# Altium project hwcb.PrjPcb
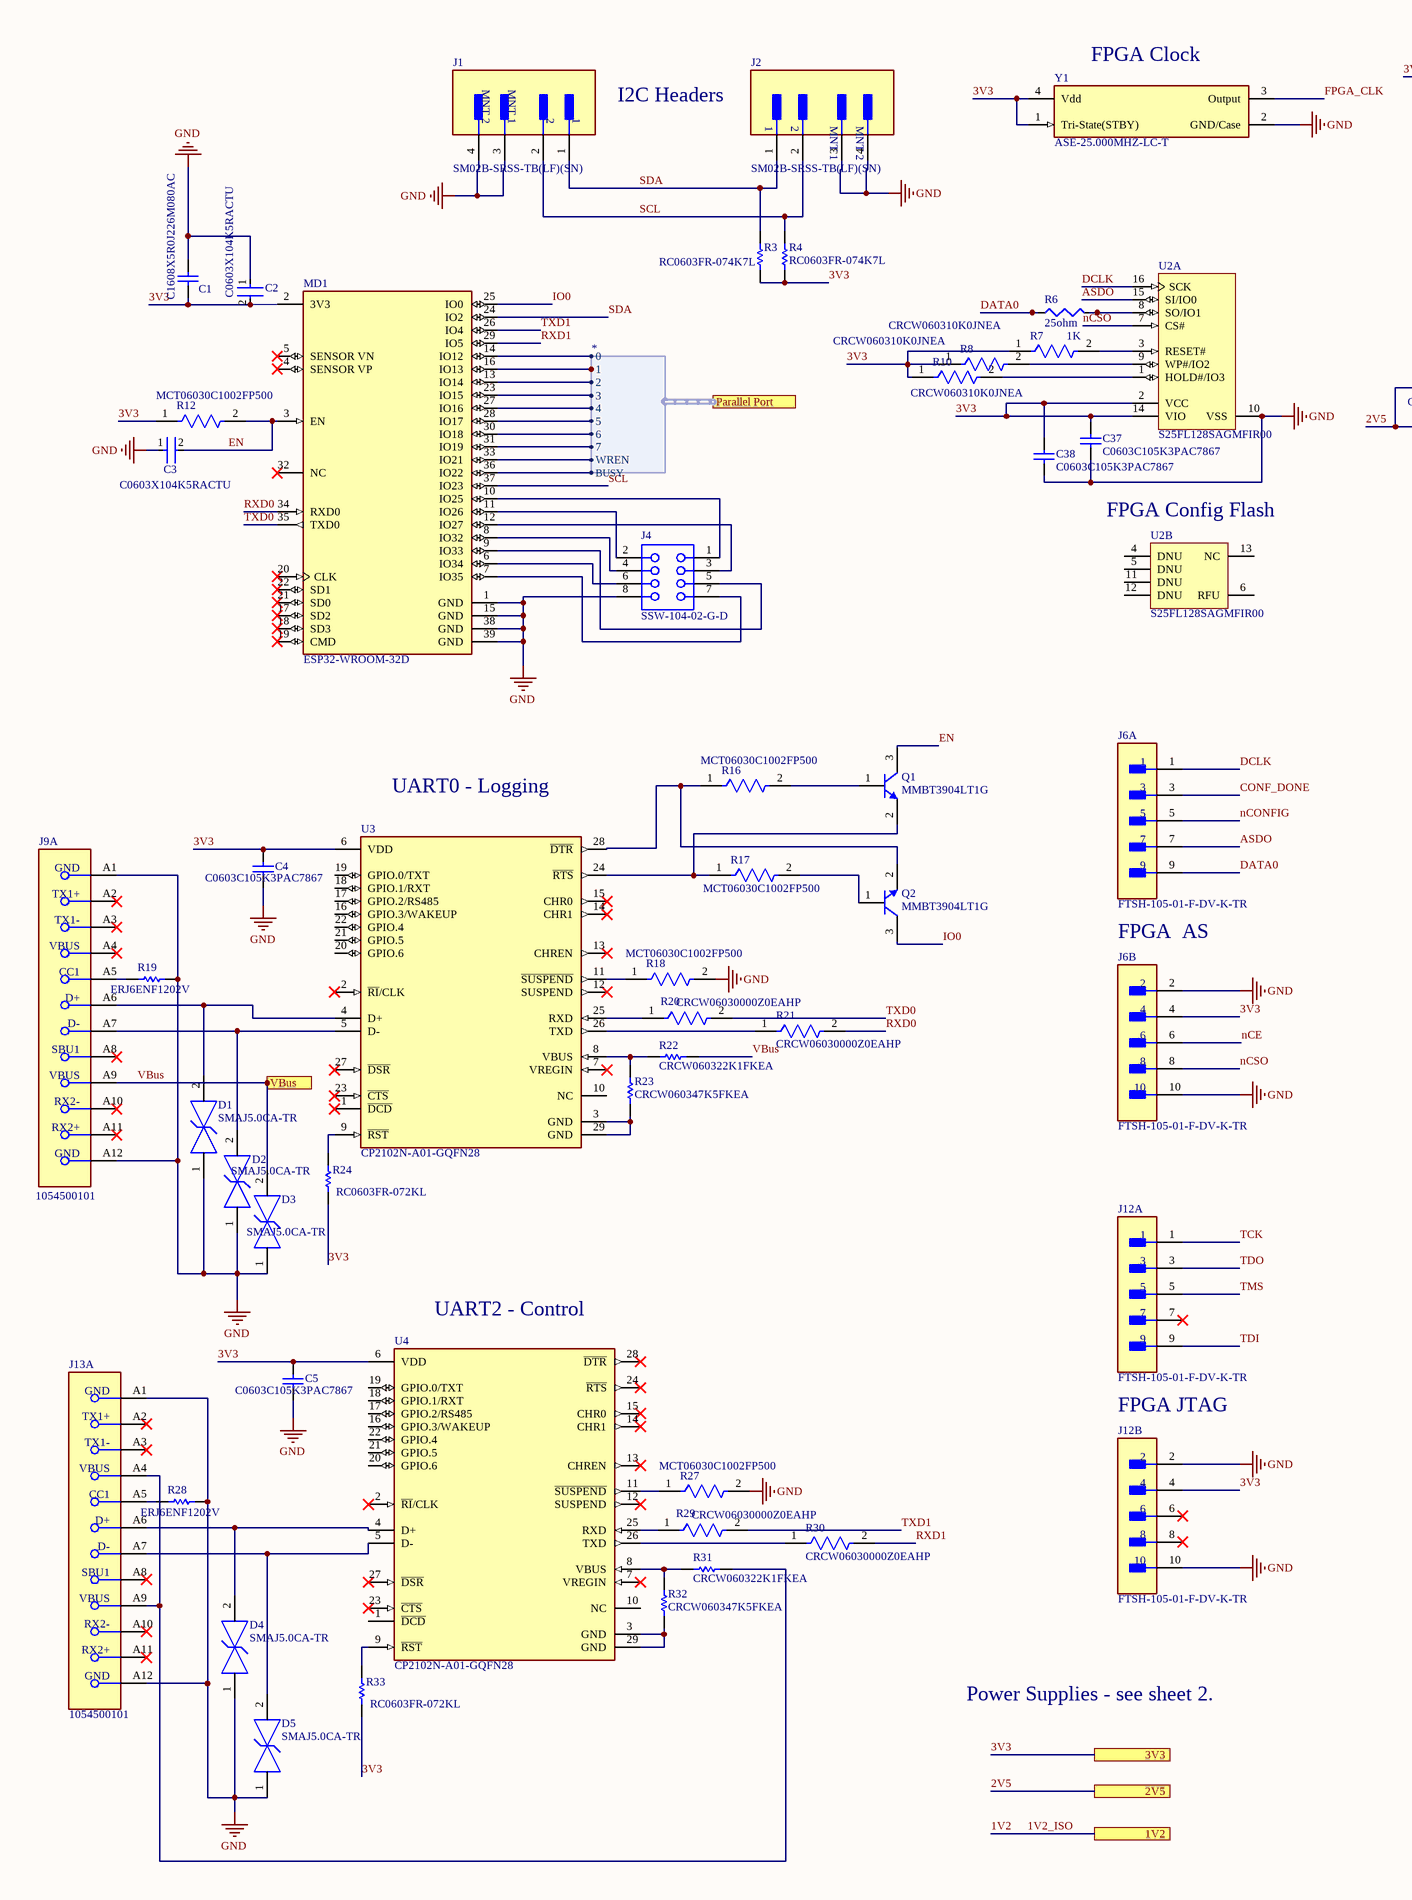
[diagram p0: hwcb.SchDoc, left]
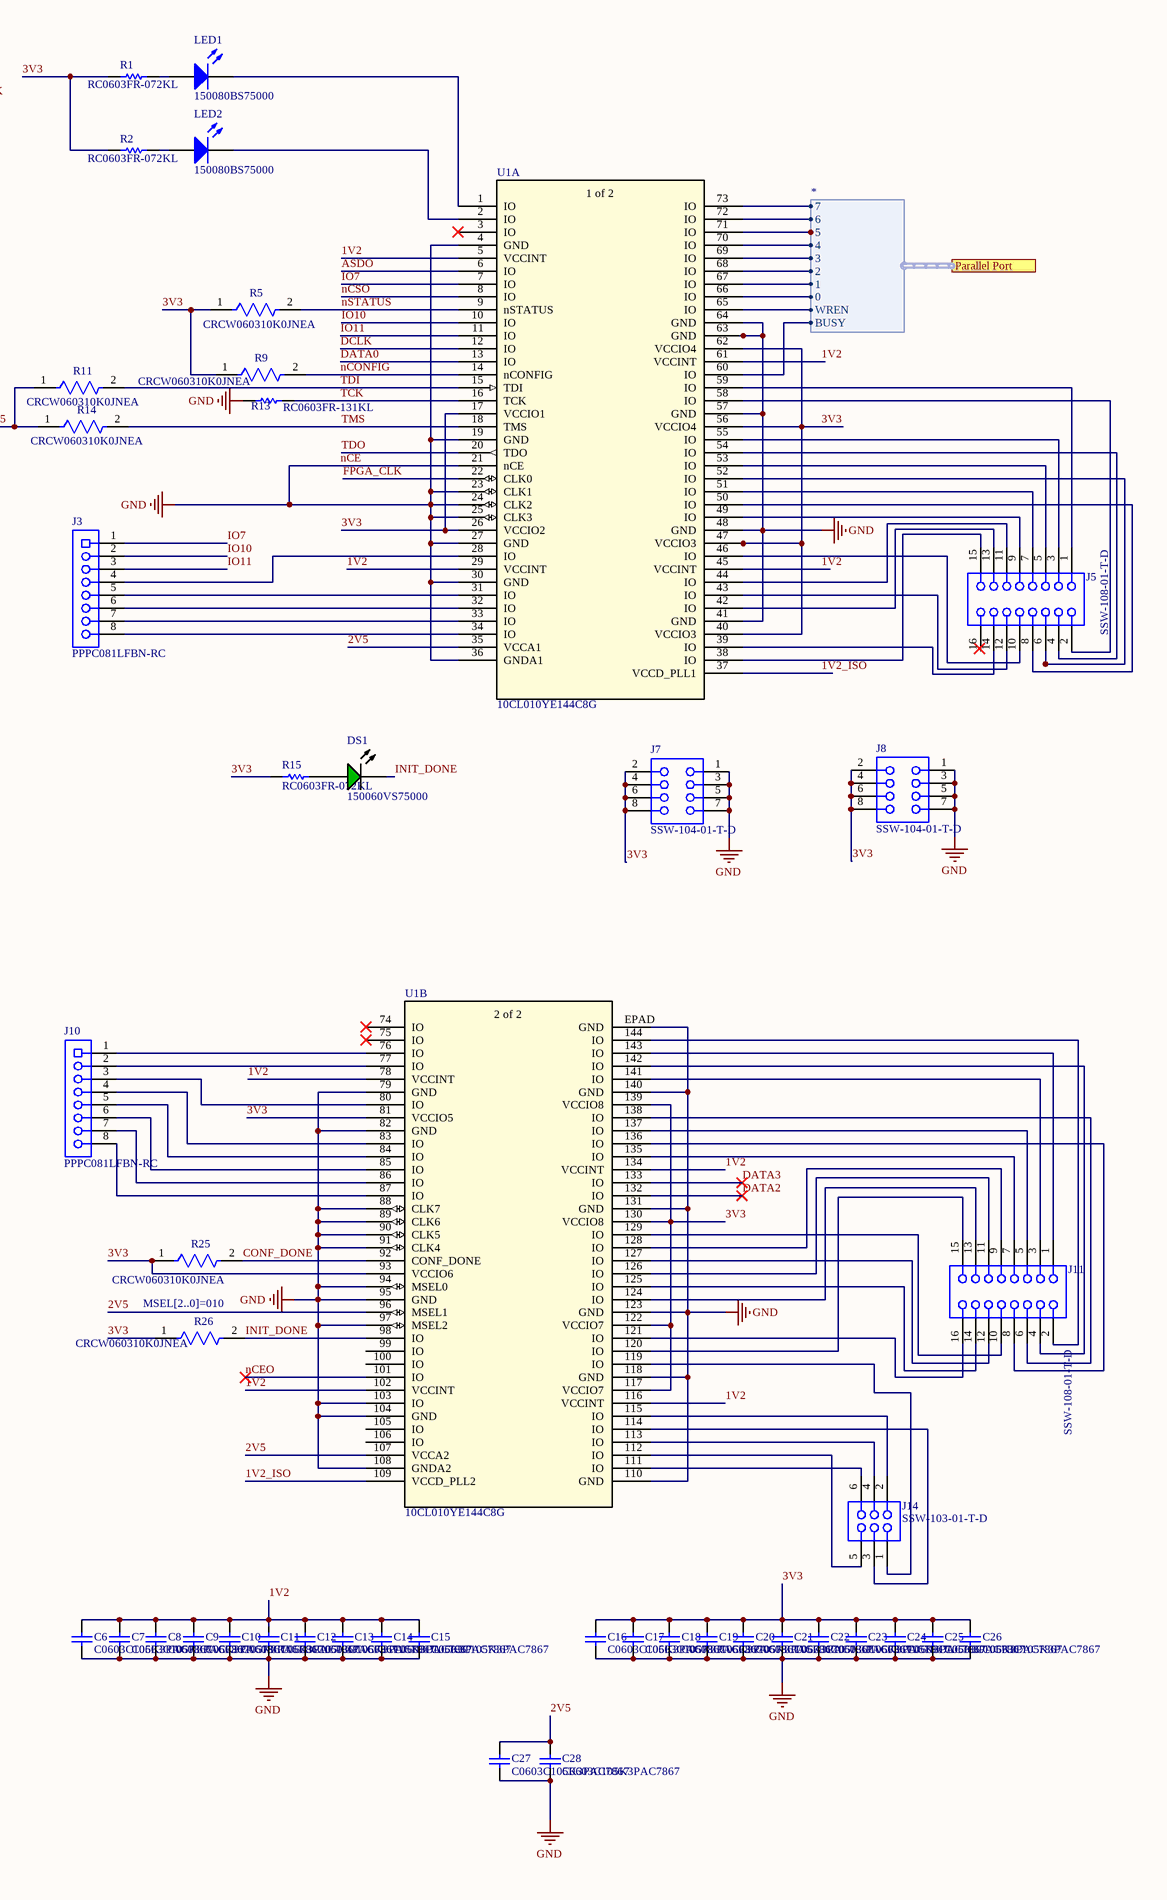
[diagram p1: hwcb.SchDoc, right]
2 sheets, 106 parts. Net scope: flat (ports and power ports of the same name join across sheets).
Board file: hwcb.PcbDoc
Sheets:
  hwcb.SchDoc
  hwcb_2.SchDoc

## Sheet hwcb.SchDoc
size C; SheetNumber: 1; SheetTotal: 2

### Parts
C1  C1608X5R0J226M080AC  [CAPC1608X100X20ML10]
C2  C0603X104K5RACTU  [FP-C0603-CJ-MFG]
C3  C0603X104K5RACTU  [FP-C0603-CJ-MFG]
C4  C0603C105K3PAC7867  [CAPC1608X90X35LL15T15]
C5  C0603C105K3PAC7867  [CAPC1608X90X35LL15T15]
C6  C0603C105K3PAC7867  [CAPC1608X90X35LL15T15]
C7  C0603C105K3PAC7867  [CAPC1608X90X35LL15T15]
C8  C0603C105K3PAC7867  [CAPC1608X90X35LL15T15]
C9  C0603C105K3PAC7867  [CAPC1608X90X35LL15T15]
C10  C0603C105K3PAC7867  [CAPC1608X90X35LL15T15]
C11  C0603C105K3PAC7867  [CAPC1608X90X35LL15T15]
C12  C0603C105K3PAC7867  [CAPC1608X90X35LL15T15]
C13  C0603C105K3PAC7867  [CAPC1608X90X35LL15T15]
C14  C0603C105K3PAC7867  [CAPC1608X90X35LL15T15]
C15  C0603C105K3PAC7867  [CAPC1608X90X35LL15T15]
C16  C0603C105K3PAC7867  [CAPC1608X90X35LL15T15]
C17  C0603C105K3PAC7867  [CAPC1608X90X35LL15T15]
C18  C0603C105K3PAC7867  [CAPC1608X90X35LL15T15]
C19  C0603C105K3PAC7867  [CAPC1608X90X35LL15T15]
C20  C0603C105K3PAC7867  [CAPC1608X90X35LL15T15]
C21  C0603C105K3PAC7867  [CAPC1608X90X35LL15T15]
C22  C0603C105K3PAC7867  [CAPC1608X90X35LL15T15]
C23  C0603C105K3PAC7867  [CAPC1608X90X35LL15T15]
C24  C0603C105K3PAC7867  [CAPC1608X90X35LL15T15]
C25  C0603C105K3PAC7867  [CAPC1608X90X35LL15T15]
C26  C0603C105K3PAC7867  [CAPC1608X90X35LL15T15]
C27  C0603C105K3PAC7867  [CAPC1608X90X35LL15T15]
C28  C0603C105K3PAC7867  [CAPC1608X90X35LL15T15]
C37  C0603C105K3PAC7867  [CAPC1608X90X35LL15T15]
C38  C0603C105K3PAC7867  [CAPC1608X90X35LL15T15]
D1  SMAJ5.0CA-TR  [FP-SMA-MFG]
D2  SMAJ5.0CA-TR  [FP-SMA-MFG]
D3  SMAJ5.0CA-TR  [FP-SMA-MFG]
D4  SMAJ5.0CA-TR  [FP-SMA-MFG]
D5  SMAJ5.0CA-TR  [FP-SMA-MFG]
DS1  150060VS75000  [WE-150060VS75000_V]
J1  SM02B-SRSS-TB(LF)(SN)  [FP-SM02B-SRSS-TB_LF_SN-0]
J2  SM02B-SRSS-TB(LF)(SN)  [FP-SM02B-SRSS-TB_LF_SN-0]
J3  PPPC081LFBN-RC  [SLIN-PPPC081LFBN-RC_V]
J4  SSW-104-02-G-D  [SMTC-SSW-104-02-X-D]
J5  SSW-108-01-T-D  [SMTC-SSW-108-01-X-D]
J6  FTSH-105-01-F-DV-K-TR  [FP-FTSH-105-01-F-DV-K-TR-MFG]  (parts A,B of 2)
J7  SSW-104-01-T-D  [SMTC-SSW-104-01-X-D]
J8  SSW-104-01-T-D  [SMTC-SSW-104-01-X-D]
J9  1054500101  [FP-1054500101-MFG]  (part A of 3)
J10  PPPC081LFBN-RC  [SLIN-PPPC081LFBN-RC_V]
J11  SSW-108-01-T-D  [SMTC-SSW-108-01-X-D]
J12  FTSH-105-01-F-DV-K-TR  [FP-FTSH-105-01-F-DV-K-TR-MFG]  (parts A,B of 2)
J13  1054500101  [FP-1054500101-MFG]  (part A of 3)
J14  SSW-103-01-T-D  [SMTC-SSW-103-01-X-D]
LED1  150080BS75000  [0805_A]
LED2  150080BS75000  [0805_A]
MD1  ESP32-WROOM-32D  [FP-ESP32-WROOM-32D-MFG]
Q1  MMBT3904LT1G  [ONSC-SOT-23-3-318-08_V]
Q2  MMBT3904LT1G  [ONSC-SOT-23-3-318-08_V]
R1  RC0603FR-072KL  [RESC1608X55X25LL10T15]
R2  RC0603FR-072KL  [RESC1608X55X25LL10T15]
R3  RC0603FR-074K7L  [RESC1608X55X25LL10T15]
R4  RC0603FR-074K7L  [RESC1608X55X25LL10T15]
R5  CRCW060310K0JNEA  [FP-CRCW0603-e3-MFG]
R6  25ohm  value 1K  [J1-0603]
R7  CRCW060310K0JNEA  [FP-CRCW0603-e3-MFG]
R8  CRCW060310K0JNEA  [FP-CRCW0603-e3-MFG]
R9  CRCW060310K0JNEA  [FP-CRCW0603-e3-MFG]
R10  CRCW060310K0JNEA  [FP-CRCW0603-e3-MFG]
R11  CRCW060310K0JNEA  [FP-CRCW0603-e3-MFG]
R12  MCT06030C1002FP500  [FP-MCT0603-IPC_C]
R13  RC0603FR-131KL  [RESC1608X55X25NL10T15]
R14  CRCW060310K0JNEA  [FP-CRCW0603-e3-MFG]
R15  RC0603FR-072KL  [RESC1608X55X25LL10T15]
R16  MCT06030C1002FP500  [FP-MCT0603-IPC_C]
R17  MCT06030C1002FP500  [FP-MCT0603-IPC_C]
R18  MCT06030C1002FP500  [FP-MCT0603-IPC_C]
R19  ERJ6ENF1202V  [RESC2013X70X40ML20T20]
R20  CRCW06030000Z0EAHP  [FP-CRCW0603-HPe3-MFG]
R21  CRCW06030000Z0EAHP  [FP-CRCW0603-HPe3-MFG]
R22  CRCW060322K1FKEA  [RESC1609X50X30LL10T20]
R23  CRCW060347K5FKEA  [RESC1609X50X30LL10T20]
R24  RC0603FR-072KL  [RESC1608X55X25LL10T15]
R25  CRCW060310K0JNEA  [FP-CRCW0603-e3-MFG]
R26  CRCW060310K0JNEA  [FP-CRCW0603-e3-MFG]
R27  MCT06030C1002FP500  [FP-MCT0603-IPC_C]
R28  ERJ6ENF1202V  [RESC2013X70X40ML20T20]
R29  CRCW06030000Z0EAHP  [FP-CRCW0603-HPe3-MFG]
R30  CRCW06030000Z0EAHP  [FP-CRCW0603-HPe3-MFG]
R31  CRCW060322K1FKEA  [RESC1609X50X30LL10T20]
R32  CRCW060347K5FKEA  [RESC1609X50X30LL10T20]
R33  RC0603FR-072KL  [RESC1608X55X25LL10T15]
U1  10CL010YE144C8G  [EQFP144_A-1P65_D2-6P7_INT]  (parts A,B of 2)
U2  S25FL128SAGMFIR00  [SPSN-SOIC-16_M]  (parts A,B of 2)
U3  CP2102N-A01-GQFN28  [FP-CP2102N-A01-GQFN28-MFG]
U4  CP2102N-A01-GQFN28  [FP-CP2102N-A01-GQFN28-MFG]
Y1  ASE-25.000MHZ-LC-T  [FP-ASE-MFG]

### Ports
1V2, 2V5, 3V3, Parallel Port (harness *), VBus

### Harnesses
*: 0, 1, 2, 3, 4, 5, 6, 7, WREN, BUSY

### Nets
nCE: C1.2 C2.1 C3.1 C4.2 C5.2 C6.2 C7.2 C8.2 C9.2 C10.2 C11.2 C12.2 C13.2 C14.2 C15.2 C16.2 C17.2 C18.2 C19.2 C20.2 C21.2 C22.2 C23.2 C24.2 C25.2 C26.2 C27.2 C28.2 C37.2 C38.2 D1.1 D2.1 D3.1 D4.1 D5.1 J1.3(MNT_1) J1.4(MNT_2) J2.3(MNT_1) J2.4(MNT_2) J4.8 J6.2 J6.6 J6.10 J7.1 J7.3 J7.5 J7.7 J8.1 J8.3 J8.5 J8.7 J9.A1(GND) J9.A12(GND) J12.2 J12.10 J13.A1(GND) J13.A12(GND) MD1.1(GND) MD1.15(GND) MD1.38(GND) MD1.39(GND) R13.1 R18.2 R19.2 R27.2 R28.2 U1.4(GND) U1.19(GND) U1.21(nCE) U1.23(CLK1) U1.24(CLK2) U1.25(CLK3) U1.27(GND) U1.30(GND) U1.36(GNDA1) U1.41(GND) U1.48(GND) U1.57(GND) U1.63(GND) U1.64(GND) U1.79(GND) U1.82(GND) U1.88(CLK7) U1.89(CLK6) U1.90(CLK5) U1.91(CLK4) U1.94(MSEL0) U1.95(GND) U1.97(MSEL2) U1.103(IO) U1.104(GND) U1.108(GNDA2) U1.110(GND) U1.118(GND) U1.123(GND) U1.131(GND) U1.140(GND) U1.EPAD(GND) U2.10(VSS) Y1.2(GND/Case)  [also labelled GND]
1V2: C6.1 C7.1 C8.1 C9.1 C10.1 C11.1 C12.1 C13.1 C14.1 C15.1 U1.5(VCCINT) U1.29(VCCINT) U1.37(VCCD_PLL1) U1.45(VCCINT) U1.61(VCCINT) U1.78(VCCINT) U1.102(VCCINT) U1.109(VCCD_PLL2) U1.116(VCCINT) U1.134(VCCINT) ; port 1V2  [also labelled 1V2_ISO]
2V5: C27.1 C28.1 R11.1 R14.1 U1.35(VCCA1) U1.96(MSEL1) U1.107(VCCA2) ; port 2V5
3V3: C1.1 C2.2 C4.1 C5.1 C16.1 C17.1 C18.1 C19.1 C20.1 C21.1 C22.1 C23.1 C24.1 C25.1 C26.1 C37.1 C38.1 J6.4 J7.2 J7.4 J7.6 J7.8 J8.2 J8.4 J8.6 J8.8 J12.4 MD1.2(3V3) R1.1 R2.1 R3.2 R4.2 R5.1 R7.1 R8.1 R9.1 R10.1 R12.1 R15.1 R24.2 R25.1 R26.1 R33.2 U1.17(VCCIO1) U1.26(VCCIO2) U1.40(VCCIO3) U1.47(VCCIO3) U1.56(VCCIO4) U1.62(VCCIO4) U1.81(VCCIO5) U1.93(VCCIO6) U1.117(VCCIO7) U1.122(VCCIO7) U1.130(VCCIO8) U1.139(VCCIO8) U2.2(VCC) U2.14(VIO) U3.6(VDD) U4.6(VDD) Y1.1(Tri-State(STBY)) Y1.4(Vdd) ; port 3V3
ASDO: J6.7 U1.6(IO) U2.15(SI/IO0)
CONF_DONE: J6.3 R25.2 U1.92(CONF_DONE)
DATA0: J6.9 R6.1 U1.13(IO)
DATA2: U1.132(IO)
DATA3: U1.133(IO)
DCLK: J6.1 U1.12(IO) U2.16(SCK)
EN: C3.2 MD1.3(EN) Q1.3(C) R12.2
FPGA_CLK: U1.22(CLK0) Y1.3(Output)
INIT_DONE: DS1.1(K) R26.2 U1.98(IO)
IO0: MD1.25(IO0) Q2.3(C)
IO7: J3.1 U1.7(IO)
IO10: J3.2 U1.10(IO)
IO11: J3.3 U1.11(IO)
nCEO: U1.101(IO)
nCONFIG: J6.5 R9.2 U1.14(nCONFIG)
nCSO: J6.8 U1.8(IO) U2.7(CS#)
nSTATUS: R5.2 U1.9(nSTATUS)
RXD0: MD1.34(RXD0) R21.2
RXD1: MD1.29(IO5) R30.2
SCL: J1.2 J2.2 MD1.37(IO23) R4.1
SDA: J1.1 J2.1 MD1.24(IO2) R3.1
TCK: J12.1 R13.2 U1.16(TCK)
TDI: J12.9 R11.2 U1.15(TDI)
TDO: J12.3 U1.20(TDO)
TMS: J12.5 R14.2 U1.18(TMS)
TXD0: MD1.35(TXD0) R20.2
TXD1: MD1.26(IO4) R29.2
VBus: D3.2 J9.A9(VBUS) R22.2 ; port VBus  [project net 5V]
NetD1_2: D1.2 J9.A6(D+) U3.4(D+)
NetD2_2: D2.2 J9.A7(D-) U3.5(D-)
NetD4_2: D4.2 J13.A6(D+) U4.4(D+)
NetD5_2: D5.2 J13.A7(D-) U4.5(D-)
NetDS1_2: DS1.2(A) R15.2
NetJ3_4: J3.4 U1.28(IO)
NetJ3_5: J3.5 U1.31(IO)
NetJ3_6: J3.6 U1.32(IO)
NetJ3_7: J3.7 U1.33(IO)
NetJ3_8: J3.8 U1.34(IO)
NetJ4_1: J4.1 MD1.10(IO25)
NetJ4_2: J4.2 MD1.11(IO26)
NetJ4_3: J4.3 MD1.12(IO27)
NetJ4_4: J4.4 MD1.8(IO32)
NetJ4_5: J4.5 MD1.9(IO33)
NetJ4_6: J4.6 MD1.6(IO34)
NetJ4_7: J4.7 MD1.7(IO35)
NetJ5_1: J5.1 U1.59(IO)
NetJ5_2: J5.2 U1.58(IO)
NetJ5_3: J5.3 U1.55(IO)
NetJ5_4: J5.4 U1.54(IO)
NetJ5_5: J5.5 U1.53(IO)
NetJ5_6: J5.6 U1.52(IO)
NetJ5_7: J5.7 U1.51(IO)
NetJ5_8: J5.8 U1.50(IO)
NetJ5_9: J5.9 U1.49(IO)
NetJ5_10: J5.10 U1.46(IO)
NetJ5_11: J5.11 U1.44(IO)
NetJ5_12: J5.12 U1.43(IO)
NetJ5_13: J5.13 U1.42(IO)
NetJ5_14: J5.14 U1.39(IO)
NetJ5_15: J5.15 U1.38(IO)
NetJ9_A5: J9.A5(CC1) R19.1
NetJ10_1: J10.1 U1.76(IO)
NetJ10_2: J10.2 U1.77(IO)
NetJ10_3: J10.3 U1.80(IO)
NetJ10_4: J10.4 U1.83(IO)
NetJ10_5: J10.5 U1.84(IO)
NetJ10_6: J10.6 U1.85(IO)
NetJ10_7: J10.7 U1.86(IO)
NetJ10_8: J10.8 U1.87(IO)
NetJ11_1: J11.1 U1.143(IO)
NetJ11_2: J11.2 U1.144(IO)
NetJ11_3: J11.3 U1.141(IO)
NetJ11_4: J11.4 U1.142(IO)
NetJ11_5: J11.5 U1.137(IO)
NetJ11_6: J11.6 U1.138(IO)
NetJ11_7: J11.7 U1.135(IO)
NetJ11_8: J11.8 U1.136(IO)
NetJ11_9: J11.9 U1.128(IO)
NetJ11_10: J11.10 U1.129(IO)
NetJ11_11: J11.11 U1.126(IO)
NetJ11_12: J11.12 U1.127(IO)
NetJ11_13: J11.13 U1.124(IO)
NetJ11_14: J11.14 U1.125(IO)
NetJ11_15: J11.15 U1.120(IO)
NetJ11_16: J11.16 U1.121(IO)
NetJ13_A4: J13.A4(VBUS) J13.A9(VBUS) R31.2
NetJ13_A5: J13.A5(CC1) R28.1
NetJ14_1: J14.1 U1.119(IO)
NetJ14_2: J14.2 U1.115(IO)
NetJ14_3: J14.3 U1.114(IO)
NetJ14_4: J14.4 U1.113(IO)
NetJ14_5: J14.5 U1.112(IO)
NetJ14_6: J14.6 U1.111(IO)
NetLED1_1: LED1.1(K) U1.1(IO)
NetLED1_2: LED1.2(A) R1.2
NetLED2_1: LED2.1(K) U1.2(IO)
NetLED2_2: LED2.2(A) R2.2
NetMD1_13: MD1.13(IO14) U1.68(IO) ; port Parallel Port.2
NetMD1_14: MD1.14(IO12) U1.66(IO) ; port Parallel Port.0
NetMD1_16: MD1.16(IO13) U1.67(IO) ; port Parallel Port.1
NetMD1_23: MD1.23(IO15) U1.69(IO) ; port Parallel Port.3
NetMD1_27: MD1.27(IO16) U1.70(IO) ; port Parallel Port.4
NetMD1_28: MD1.28(IO17) U1.71(IO) ; port Parallel Port.5
NetMD1_30: MD1.30(IO18) U1.72(IO) ; port Parallel Port.6
NetMD1_31: MD1.31(IO19) U1.73(IO) ; port Parallel Port.7
NetMD1_33: MD1.33(IO21) U1.65(IO) ; port Parallel Port.WREN
NetMD1_36: MD1.36(IO22) U1.60(IO) ; port Parallel Port.BUSY
NetQ1_1: Q1.1(B) R16.2
NetQ1_2: Q1.2(E) R17.1 U3.24(~{RTS})
NetQ2_1: Q2.1(B) R17.2
NetQ2_2: Q2.2(E) R16.1 U3.28(~{DTR})
NetR6_2: R6.2 U2.8(SO/IO1)
NetR7_2: R7.2 U2.3(RESET#)
NetR8_2: R8.2 U2.9(WP#/IO2)
NetR10_2: R10.2 U2.1(HOLD#/IO3)
NetR18_1: R18.1 U3.11(~{SUSPEND})
NetR20_1: R20.1 U3.25(RXD)
NetR21_1: R21.1 U3.26(TXD)
NetR22_1: R22.1 R23.2 U3.8(VBUS)
NetR23_1: R23.1 U3.3(GND) U3.29(GND)
NetR24_1: R24.1 U3.9(~{RST})
NetR27_1: R27.1 U4.11(~{SUSPEND})
NetR29_1: R29.1 U4.25(RXD)
NetR30_1: R30.1 U4.26(TXD)
NetR31_1: R31.1 R32.2 U4.8(VBUS)
NetR32_1: R32.1 U4.3(GND) U4.29(GND)
NetR33_1: R33.1 U4.9(~{RST})

Not connected (* = marked no-connect by the designer): J5 16; J9 A2(TX1+)* A3(TX1-)* A4(VBUS)* A8(SBU1)* A10(RX2-)* A11(RX2+)*; J12 6* 7* 8*; J13 A2(TX1+)* A3(TX1-)* A8(SBU1)* A10(RX2-)* A11(RX2+)*; MD1 4(SENSOR_VP)* 5(SENSOR_VN)* 17(SD2)* 18(SD3)* 19(CMD)* 20(CLK)* 21(SD0)* 22(SD1)* 32(NC)*; U1 3(IO)* 74(IO)* 75(IO)* 99(IO) 100(IO) 105(IO) 106(IO); U2 4(DNU) 5(DNU) 6(RFU) 11(DNU) 12(DNU) 13(NC); U3 1(~{DCD})* 2(~{RI}/CLK)* 7(VREGIN)* 10(NC) 12(SUSPEND)* 13(CHREN)* 14(CHR1)* 15(CHR0)* 16(GPIO.3/WAKEUP) 17(GPIO.2/RS485) 18(GPIO.1/RXT) 19(GPIO.0/TXT) 20(GPIO.6) 21(GPIO.5) 22(GPIO.4) 23(~{CTS})* 27(~{DSR})*; U4 1(~{DCD}) 2(~{RI}/CLK)* 7(VREGIN)* 10(NC) 12(SUSPEND)* 13(CHREN)* 14(CHR1)* 15(CHR0)* 16(GPIO.3/WAKEUP) 17(GPIO.2/RS485) 18(GPIO.1/RXT) 19(GPIO.0/TXT) 20(GPIO.6) 21(GPIO.5) 22(GPIO.4) 23(~{CTS})* 24(~{RTS})* 27(~{DSR})* 28(~{DTR})*

### Notes on the sheet
- (near Y1) FPGA Clock
- I2C Headers
- FPGA Config Flash
- (near U3) UART0 - Logging
- (near J6) FPGA  AS
- MSEL[2..0]=010
- (near U4) UART2 - Control
- (near J12) FPGA JTAG
- Power Supplies - see sheet 2.
- (in symbol 10CL010YE144C8G, part A) 1 of 2
- (in symbol 10CL010YE144C8G, part B) 2 of 2

### Library data of the parts
C1 = CMP-2000-05440-1: Chip Capacitor, 22 uF, +/- 20%, 6.3 V, -55 to 85 degC, 1608 (0603 Metric), RoHS, Tape and Reel; PCN Part Number: MLCCPartNumberChange30/Nov/2012; Manufacturer: TDK; Temperature Coefficient: X5R; Product Training Modules: CSeriesGeneralApplicationsSEAT,CCV,andTVCLDesignToolsGuidetoReplacinganElectrolyticCapacitorwithanMLCC; Other Names: 445-8028-1; Capacitance: 22µF; Voltage - Rated: 6.3V; Design Resources: 20WNon-IsolatedBuckLEDDriverUsingPLLNK460KG; Online Catalog: CSeries,GeneralPurpose; Kits: 445-9003-KIT-ND-KITCAPCERHICAPMLCCSMD; Tolerance: ±20%; Series: C; Thickness (Max): 0.039"(1.00mm); Mounting Type: SurfaceMount,MLCC; Ratings: -; Datasheet Version: Mar-15; Package Reference: 603; Packaging: CutTape(CT); Features: -; Package / Case: 0603(1608Metric); Family: CeramicCapacitors; Lead Spacing: -; RoHS Information: RoHSCertificate-MLCC; Manufacturer URL: http://www.tdk.com/; Lead Style: -; Category: Capacitors; Applications: GeneralPurpose; Package Description: 2-Pin Surface Mount Device, Body 1.6 x 0.8 mm; Standard Package: 1; Datasheet URL: http://www.farnell.com/datasheets/1913358.pdf; Height - Seated (Max): -; Operating Temperature: -55degC~85degC; Size / Dimension: 0.063"Lx0.031"W(1.60mmx0.80mm)
C2 C3 = CMP-2006-03300-2: CAP CER 0.1UF 50V X7R 0603; Manufacturer: Kemet; Capacitance: 100nF; Material: Ceramic; Tolerance: 10%; Value: 100nF; Temperature Coefficient: 15%; Temperature Range High: +125°C; Temperature Range Low: -55°C; Manufacturer Part Number: C0603X104K5RACTU; Voltage: 50V; ComponentLink2Description: Datasheet; RoHS: TRUE; ComponentLink2URL: https://content.kemet.com/datasheets/KEM_C1013_X7R_FT-CAP_SMD.pdf; Device Class L3: Ceramic Capacitors; Device Class L2: Capacitors; Package: C0603-CJ; Height: 0.95mm; Device Class L1: Passive Components; Temperature Characteristic: X7R; Lead Free: Yes; Digikey Description: CAP CER 0.1UF 50V X7R 0603; Automotive: No; Mouser Description: Capacitor; Ceramic; Cap 0.1uF; Tol+10%; SMT; Flexible Termination; Vol-Rtg 50V; TR; Temperature: -55°C to +125°C; Octopart: https://octopart.com/c0603x104k5ractu-kemet-9145062; Category: Cap; Voltage Rating: 50V; Ipc Land Pattern Name: CAPC16080X80
C4-C28 C37 C38 = CMP-2006-02216-2: Manufacturer: Kemet; Part Number: C0603C105K3PAC7867
D1-D5 = CMP-12225-000029-1: TVS DIODE 5V 13.4V SMA; Manufacturer: STMicroelectronics; Peak Pulse Power: 400W; Breakdown Voltage: 6.4V; Number Of Channels: 1; Clamping Voltage: 9.2V; Standoff Height: 0.05mm; Peak Pulse Current: 43.5A; Max Junction Temp: +150°C; Direction: Bidirectional; Height: 2.65mm; ComponentLink2Description: Datasheet; ComponentLink2URL: https://www.st.com/resource/en/datasheet/smaj.pdf; Temperature: -55°C to +150°C; Temperature Range High: +150°C; Digikey Description: TVS DIODE 5V 13.4V SMA; Device Class L1: Circuit Protection; Package: SMA; Octopart: https://octopart.com/smaj5.0ca-tr-stmicroelectronics-350177; Mouser Description: TVS Diodes - Transient Voltage Suppressors 400W 5.0V Bidirect; Temperature Range Low: -55°C; Category: Diode; Device Class L3: unset; Device Class L2: TVS Diodes; Lead Free: Yes; Automotive: No; Reverse Standoff Voltage: 5V; Manufacturer Part Number: SMAJ5.0CA-TR; RoHS: TRUE
DS1 = CMP-1426-00006-4: WL-SMCW SMD Chip LED Top View Monocolor Waterclear, 30 mA, 2 V, -40 to 85 degC, 2-Pin SMD, RoHS, Tape and Reel; DatasheetVersion: Rev. 2.7; PackageDescription: 2-Pin Surface Mount Device, Body 1.6 x 0.8 mm; ComponentLink1URL: https://www.we-online.com/; PartNumber: 150060VS75000; RoHSCompliant: True; ComponentLink2URL: http://katalog.we-online.de/led/datasheet/150060VS75000.pdf; ComponentLink1Description: Manufacturer URL; Mounting Technology: Surface Mount; ComponentLink2Description: Datasheet
J1 J2 = CMP-17439-000024-1: CONN HEADER SMD R/A 2POS 1MM; Current Rating: 700mA; Voltage Rating: 50V; Insulation Resistance: 100MR; Number of Contacts: 2; Contact Resistance: 40mR; Max Current Rating: 1A; Min Operating Temperature: -25°C; Housing Material: Polyamide; Flammability Rating: UL94 V-0; Lead Pitch: 1mm; REACH SVHC: No SVHC; Lead Free: Lead Free; Contact Finish - Mating: TIN; Packaging: Tape and Reel; Series: SR; Length: 4mm; Color: Natural; Housing Color: Beige; Number of Rows: 1; Insulation Color: Natural; Connector Type: Header; Contact Shape: Square; Depth: 4.95mm; Termination: Solder; Voltage Rating (AC): 50V; Max Operating Temperature: 85°C; Pitch: 1mm; Fastening Type: Pull; Number of Positions: 2; Contact Type: Male Pin; Material: Polyamide; Orientation: Right Angle; Mount: Surface Mount; Insulation Material: Nylon; Contact Plating: Copper; Max Voltage Rating (AC): 50V; Contact Material: Copper Alloy
J3 J10 = CMP-1770-00002-1: Female Header, Pitch 2.54 mm, 1 x 8 Position, Height 8.5 mm, Tail Length 3.2 mm, -40 to 105 degC, RoHS, Bulk; Case\Package: TO-252-3; Rds On Max: 115 mohm; Typical Rise Time: 90 ns; Max Power Dissipation: 2.5 W; Input Capacitance: 350 pF; Elements: 1; Height: 2.39 mm; Min Operating Temperature: -55 degC; RoHSCompliant: true; PackageDescription: Female Header, Pitch 2.54 mm, 1 x 8 Position, Height 8.5 mm, Tail Length 3.2 mm; Length: 6.73 mm; ComponentLink1Description: Datasheet; Package Quantity: 2500; Max Operating Temperature: 150 degC; Width: 6.22 mm; Radiation Hardening: No; Packaging: Tape and Reel; REACH SVHC: No SVHC; Pins: 3; PackageReference: PPPC081LFBN-RC; ComponentLink1URL: http://sullinscorp.com/catalogs/101_PAGE114-115_.100_FEMALE_HDR.pdf; DatasheetVersion: Jan-15; Mount: Surface Mount
J4 = CMP-1023-00343-1: SQ Post Socket, Through-hole, Vertical, -55 to 125 degC, 2.54mm Pitch, 8-Pin, Female, RoHS; Manufacturer: Samtec; Mounting Technology: Through-hole; ComponentLink1Description: Manufacturer URL; Orientation: Vertical; Pitch: 2.54 mm; PartNumber: SSW-104-02-G-D; ComponentLink2URL: http://www.samtec.com/documents/webfiles/pdf/SSW_TH.PDF; PackageReference: SSW-104-02-X-D; ComponentLink3Description: Package Specification; PackageVersion: CA, 6/1987; PackageDescription: Assembly, Socket Strip .016 X .031 Tail; ComponentLink2Description: Datasheet; RoHS: True; ComponentLink1URL: http://www.samtec.com; ComponentLink3URL: http://www.samtec.com/documents/webfiles/cpdf/SSW-1XX-XX-XXX-X-XX-XXX-XX-MKT.pdf; DatasheetVersion: F-214; Temperature Range: -55 to 125 degC
J5 J11 = CMP-1023-00375-1: SQ Post Socket, Through-hole, Vertical, -55 to 105 degC, 2.54mm Pitch, 16-Pin, Female, RoHS; Manufacturer: Samtec; ComponentLink3Description: Package Specification; Orientation: Vertical; RoHS: True; PackageReference: SSW-108-01-X-D; PartNumber: SSW-108-01-T-D; PackageDescription: Assembly, Socket Strip .016 X .031 Tail; ComponentLink2Description: Datasheet; ComponentLink1URL: http://www.samtec.com; PackageVersion: CA, 6/1987; ComponentLink1Description: Manufacturer URL; Mounting Technology: Through-hole; DatasheetVersion: F-214; ComponentLink3URL: http://www.samtec.com/documents/webfiles/cpdf/SSW-1XX-XX-XXX-X-XX-XXX-XX-MKT.pdf; ComponentLink2URL: http://www.samtec.com/documents/webfiles/pdf/SSW_TH.PDF; Pitch: 2.54 mm; Temperature Range: -55 to 105 degC
J6 J12 = CMP-02766-000004-2: CONN HEADER SMD 10POS 1.27MM; Number of Contacts: 10; Max Current Rating: 1.75A; Max Operating Temperature: 125°C; Number of Rows: 2; Pitch: 1.27mm; Contact Plating: Gold; Length: 6.35mm; Min Operating Temperature: -55°C; Packaging: Tape and Reel; Orientation: Straight; Contact Material: Bronze; Depth: 3.43mm; Housing Color: Black; Housing Material: Polymer; Radiation Hardening: No; Termination: Solder; Lead Free: Lead Free
J7 J8 = CMP-1023-00339-1: SQ Post Socket, Through-hole, Vertical, -55 to 105 degC, 2.54mm Pitch, 8-Pin, Female, RoHS; Manufacturer: Samtec; ComponentLink1Description: Manufacturer URL; ComponentLink3Description: Package Specification; ComponentLink2Description: Datasheet; DatasheetVersion: F-214; PackageDescription: Assembly, Socket Strip .016 X .031 Tail; ComponentLink3URL: http://www.samtec.com/documents/webfiles/cpdf/SSW-1XX-XX-XXX-X-XX-XXX-XX-MKT.pdf; PackageReference: SSW-104-01-X-D; PartNumber: SSW-104-01-T-D; PackageVersion: CA, 6/1987; ComponentLink1URL: http://www.samtec.com; ComponentLink2URL: http://www.samtec.com/documents/webfiles/pdf/SSW_TH.PDF; Temperature Range: -55 to 105 degC; Orientation: Vertical; RoHS: True; Mounting Technology: Through-hole; Pitch: 2.54 mm
J9 J13 = CMP-04767-000004-1: CONN RCP USB3.1 TYPEC 24P SMD RA; Manufacturer: Molex; Number Of Contacts: 24; Voltage Rating: 30V; Shielding: true; Is Female: yes; Current Rating: 0.25/1.25/5A; Pitch: 0.5mm; Conn Orientation: Right Angle; Package: 0; Height: 3.44mm; Footprint Url: https://www.molex.com/pdm_docs/sd/1054500101_sd.pdf; Device Class L1: Connectors; Category: Conn; Device Class L2: USB Connectors; Digikey Description: CONN RCP USB3.1 TYPEC 24P SMD RA; Contact Material: Gold,Nickel; Mouser Description: USB Shielded I/O Receptacle; Type C; Right Angle; Surface Mount; Gold over Nickel; ComponentLink2Description: Datasheet; Lead Free: Yes; Automotive: No; Temperature Range High: +85°C; RoHS: TRUE; Octopart: https://octopart.com/105450-0101-molex-68082325; ComponentLink2URL: https://www.molex.com/webdocs/datasheets/pdf/en-us/1054500101_IO_CONNECTORS.pdf; Temperature: -30°C to +85°C; Usb Standard: USB 3.1; Temperature Range Low: -30°C; Device Class L3: unset; Manufacturer Part Number: 1054500101
J14 = CMP-1023-00332-1: SQ Post Socket, Through-hole, Vertical, -55 to 105 degC, 2.54 mm Pitch, 6-Pin, Female, RoHS; Manufacturer: Samtec; Pitch: 2.54 mm; PackageDescription: Assembly, Socket Strip .016 X .031 Tail; ComponentLink1URL: http://www.samtec.com; DatasheetVersion: F-214; Orientation: Vertical; ComponentLink2URL: http://www.samtec.com/documents/webfiles/pdf/SSW_TH.PDF; PackageVersion: CA, 6/1987; ComponentLink2Description: Datasheet; PartNumber: SSW-103-01-T-D; ComponentLink3URL: http://www.samtec.com/documents/webfiles/cpdf/SSW-1XX-XX-XXX-X-XX-XXX-XX-MKT.pdf; ComponentLink3Description: Package Specification; Temperature Range: -55 to 105 degC; Mounting Technology: Through-hole; RoHS: True; ComponentLink1Description: Manufacturer URL; PackageReference: SSW-103-01-X-D
LED1 LED2 = CMP-1426-00008-1: SMD mono-color Chip LED, WL-SMCW, Blue; Manufacturer: Wuerth Elektronik; Color: Blue; ComponentLink2URL: http://katalog.we-online.com/led/datasheet/150080BS75000.pdf; ComponentLink1URL: http://www.we-online.com; ComponentLink2Description: Datasheet; PackageReference: 0805_A; ComponentLink1Description: Manufacturer URL; PartNumber: 150080BS75000
MD1 = CMP-194065-000003-1: WIFI MODULE 32MBITS SPI FLASH; Manufacturer: Espressif Systems; Max Supply Voltage: 3.6V; Nominal Supply Current: 500mA; Max Frequency: 2484MHz; Number Of Adc Channels: 16; Number Of Gpio: 32; Interface: I2C,SPI,UART,Ethernet,I2S,Other; Data Rate: 150Mbits/s; Min Supply Voltage: 3V; Bandwidth: 72MHz; Sensitivity: -98dBm; Octopart: https://octopart.com/esp32-wroom-32d-espressif+systems-91040050; Package: ESP32-WROOM-32D; ComponentLink2URL: https://www.espressif.com/sites/default/files/documentation/esp32-wroom-32d_esp32-wroom-32u_datasheet_en.pdf; Lead Free: Yes; Category: UNK; Mouser Description: Wi-Fi/BT BLE Module ESP32-D0WD, SPI Flash, UART, P; Device Class L1: Integrated Circuits (ICs); RoHS: TRUE; Temperature Range Low: -40°C; ComponentLink2Description: Datasheet; Digikey Description: WIFI MODULE 32MBITS SPI FLASH; Height: 3.2mm; Temperature: -40°C to +85°C; Manufacturer Part Number: ESP32-WROOM-32D; Device Class L3: Transceivers; Device Class L2: RF Semiconductors and Devices; Temperature Range High: +85°C; Automotive: No
Q1 Q2 = CMP-1048-00631-1: General Purpose Transistor, NPN Silicon, 3-Pin SOT-23, Pb-Free, Tape and Reel; Manufacturer: On Semiconductor; IC Continuous (A): 0.2; fT Min (MHz): 300; ComponentLink2Description: Datasheet; Polarity: NPN; PackageDescription: 3-Pin Small Outline Transistor, Body 2.92 x 1.3 mm, Pitch 0.95 mm; ComponentLink2URL: http://www.onsemi.cn/pub_link/Collateral/MMBT3904LT1-D.PDF; DatasheetVersion: Rev. 12; Mounting Technology: Surface Mount; PartNumber: MMBT3904LT1G; ComponentLink1URL: http://www.onsemi.com/; ComponentLink3Description: Package Specification; ComponentLink1Description: Manufacturer URL; PackageVersion: Rev. AP, 11/2009; PackageReference: SOT-23-3-318-08; Packing: Tape and Reel; ComponentLink3URL: http://www.onsemi.cn/pub_link/Collateral/318-08.PDF; RoHS: TRUE
R1 R2 R15 R24 R33 = CMP-2000-06937-1: Chip Resistor, 2 KOhm, +/- 1%, 50 V, -55 to 155 degC, 0603 (1608 Metric), RoHS, Tape and Reel; Manufacturer: Yageo; PCN Other: RC/AC0603/0805/120622/Jan/2013; Resistance (Ohms): 2k; Catalog Drawings: ThickFilmResistorTopThickFilmResistorSide; Kits: PHH4-KIT-ND-RESKIT1K-9.76K1/10W5700PCS; EDA / CAD Models: DownloadfromAcceleratedDesigns; HTML Datasheet: RCSeries,LSuffixDatasheet.html; Power (Watts): 0.1W,1/10W; Other Names: 311-2.00KHRCT; Temperature Coefficient: ±100ppm/°C; Online Catalog: RC0603Series; Features: MoistureResistant; Height: 0.022"(0.55mm); Size / Dimension: 0.063"Lx0.031"W(1.60mmx0.80mm); Product Training Modules: ChipResistor; Mounting Technology: SurfaceMount; Package / Case: 0603(1608Metric); Supplier Device Package: 0603; Category: Resistors; Tolerance: ±1%; Packaging: CutTape(CT); Operating Temperature: -55°C~155°C; Standard Package: 1; Series: RC; Datasheet URL: http://www.yageo.com/documents/recent/PYu-RC_Group_51_RoHS_L_7.pdf; Package Description: 2-Pin Surface Mount Device, Body 1.6 x 0.8 mm; Number of Terminations: 2; Datasheet Version: Rev. 7, 05/2017; Package Reference: 0603; Composition: ThickFilm; Manufacturer URL: http://www.yageo.com/; Family: ChipResistor-SurfaceMount
R3 R4 = CMP-2000-06942-1: Chip Resistor, 4.7 KOhm, +/- 1%, 0.1 W, -55 to 155 degC, 0603 (1608 Metric), RoHS, Tape and Reel; Manufacturer: Yageo; Power Rating: 100mW; Temperature Coefficient: 100PPM/C; Resistance: 4.7kOhms; Voltage Rating: 50V; Package Reference: 0603; Series: RC; Datasheet Version: Rev. 7, 05/2017; Packaging: Reel; Termination Style: SMD/SMT; Datasheet URL: http://www.yageo.com/documents/recent/PYu-RC_Group_51_RoHS_L_7.pdf; Manufacturer URL: http://www.yageo.com/; Package Description: 2-Pin Surface Mount Device, Body 1.6 x 0.8 mm; Case Code - mm: 1608; Case Code - in: 0603; Mounting Technology: SurfaceMount; Operating Temperature Range: -55Cto+155C; Tolerance: 1%; Product: ThickFilmResistorsGeneralPurpose
R5 R7-R11 R14 R25 R26 = CMP-2000-03838-2: RES Thick Film, 10kΩ, 5%, 0.1W, 200ppm/°C, 0603; Max Power Dissipation: 100mW; Voltage Rating: 75V; Resistance: 10kR; Termination: SMD/SMT; Depth: 0.85mm; Weight: 7.1E-05oz; Military Standard: Not; Case Code (Imperial): 0603; Lead Free: Lead Free; Features: Automotive AEC-Q200; Tolerance: 5%; Case Code (Metric): 1608; Package Quantity: 1; Radiation Hardening: No; Number of Terminations: 2; Max Operating Temperature: 155°C; Min Operating Temperature: -55°C; Composition: Thick Film; Number of Pins: 2; Height: 0.02inch; Contact Plating: Tin; Temperature Coefficient: 200ppm/°C; Width: 0.033inch; Packaging: Tape and Reel; Length: 1.55mm; Mount: Surface Mount; Voltage Rating (DC): 75V; Case/Package: 0603; Power Rating: 100mW
R6 = Res3: Resistor; Published: 8-Jun-2000; LatestRevisionDate: 29-May-2009; LatestRevisionNote: IPC-7351 Footprint Added.; PackageReference: J1-0603; Publisher: Altium Limited; PackageDescription: Chip Resistor
R12 R16-R18 R27 = CMP-02407-000418-1: RES SMD 100 OHM 1% 1/8W 0603; Voltage Rating: 75V; Power Rating: 100mW; Temperature Coefficient: 50ppm/°C; Max Power Dissipation: 125mW; Resistance: 10kR; Case/Package: 0603; Military Standard: Not; Min Operating Temperature: -55°C; Width: 0.8mm; Package Quantity: 1; Max Operating Temperature: 125°C; Tolerance: 1%; Depth: 0.85mm; Radiation Hardening: No; Mount: Surface Mount; Composition: Thin Film; Contact Plating: Tin; Lead Free: Lead Free; Case Code (Imperial): 0603; Number of Terminations: 2; Voltage Rating (DC): 75V; Length: 1.55mm; Packaging: Tape and Reel; Height: 0.022inch; Case Code (Metric): 1608
R13 = CMP-2000-04205-1: Manufacturer: Yageo; Part Number: RC0603FR-131KL
R19 R28 = CMP-2001-00513-1: Manufacturer: Panasonic; Part Number: ERJ6ENF1202V
R20 R21 R29 R30 = CMP-2000-03817-2: RES Thick Film, 0Ω, , 0.33W, , 0603; Max Power Dissipation: 250mW; Voltage Rating (DC): 75V; Temperature Coefficient: 0ppm/°C; Resistance: 0mR; Mount: Surface Mount; Package Quantity: 5000; Features: Automotive AEC-Q200; Length: 1.6mm; Width: 0.033inch; Min Operating Temperature: -55°C; Max Operating Temperature: 155°C; Contact Plating: Tin; Depth: 0.85mm; Case/Package: 0603; Radiation Hardening: No; Military Standard: Not; Power Rating: 250mW; Height: 0.45mm; Composition: Thick Film; Lead Free: Lead Free; Voltage Rating: 75V; Case Code (Imperial): 0603; Weight: 7.1E-05oz; Number of Terminations: 2; Packaging: Tape and Reel; Number of Pins: 2; Case Code (Metric): 1608; Termination: SMD/SMT
R22 R31 = CMP-2000-03094-1: Manufacturer: Vishay Dale; Part Number: CRCW060322K1FKEA
R23 R32 = CMP-1012-00700-2: Manufacturer: Vishay Dale; Part Number: CRCW060347K5FKEA
U1 = 10CL010YE144C8G: No Description Available; Vendor: Intel; Built_By: EMA_Cory; SourceLibrary: Intel_2020-07-08; Datasheet: https://www.mouser.com/datasheet/2/612/c10lp-51001-1114189.pdf; Manufacturer_Part_Number: 10CL010YE144C8G; Copyright: Copyright (C) 2018 Accelerated Designs. All rights reserved; RefDes: RefDes; Type: DEV
U2 = CMP-1329-00025-1: MirrorBit Flash Non-Volatile Memory CMOS 3.0 Volt Core with Versatile I/O, Serial Peripheral Interface with Multi-I/O, 128 Mbit, 133 MHz, -40 to 85 degC, 16-Pin SO (SO3016), RoHS, Tray; Manufacturer: Spansion; Speed: 133 MHz; OTP: 1024 B; VCC: 2.7 to 3.6 V; RoHS: TRUE; DatasheetVersion: Rev. 08; Temperature Range: -40 to 85 degC; PartNumber: S25FL128SAGMFIR00; PackageDescription: 16-Pin Wide Plastic Small Outline Package, Body 10.3 x 7.5 mm, Pitch 1.27 mm; ComponentLink3URL: http://www.spansion.com/Support/Datasheets/S25FL128S_256S_00.pdf; Mounting Technology: Surface Mount; ComponentLink2URL: http://www.spansion.com/Support/Datasheets/S25FL128S_256S_00.pdf; ComponentLink3Description: Package Specification; Density: 128 Mbit; ComponentLink2Description: Datasheet; ComponentLink1Description: Manufacturer URL; ComponentLink1URL: http://www.spansion.com/Pages/Default.aspx; Packing: Tray
U3 U4 = CMP-08093-000004-1: IC BRIDGE USB TO UART 28QFN; Manufacturer: Silicon Labs; Standoff Height: 0mm; Max Junction Temp: +105°C; Usb Standard: USB 2.0; Number Of Ports: 1; Nominal Supply Current: 195-13700uA; Min Supply Voltage: 1.71V; Max Supply Voltage: 5.25V; Interface: UART,USB,RS-232,RS-485; Height: 0.8mm; Package: CP2102N-A01-GQFN28; Temperature Range Low: -40°C; Lead Free: Yes; Category: IC; Ambient Temperature Range High: +85°C; Device Class L3: USB Interface ICs; Octopart: https://octopart.com/cp2102n-a01-gqfn28-silicon+labs-74636024; Manufacturer Part Number: CP2102N-A01-GQFN28; Device Class L2: Interface ICs; ComponentLink2URL: https://media.digikey.com/pdf/Data%20Sheets/Silicon%20Laboratories%20PDFs/CP2102N_Rev.1.3_DS.pdf; Automotive: No; Temperature: -40°C to +85°C; Device Class L1: Integrated Circuits (ICs); Mouser Description: IC BRIDGE USB TO UART 28QFN; RoHS: TRUE; Ambient Temperature Range Low: -40°C; Temperature Range High: +85°C; Ipc Land Pattern Name: QFN50P500X500X75-28; Digikey Description: IC BRIDGE USB TO UART 28QFN; ComponentLink2Description: Datasheet
Y1 = CMP-2000-05795-2: XTAL OSC XO 25.0000MHZ CMOS SMD; Manufacturer: Abracon; Max Supply Current: 13mA; Load Capacitance: 15pF; Stability: 50ppm; Frequency: 25MHz; Min Supply Voltage: 3.135V; Max Supply Voltage: 3.465V; ComponentLink2Description: Datasheet; Device Class L3: Oscillators; Lead Free: Yes; Series: ASE; Manufacturer Part Number: ASE-25.000MHZ-LC-T; Package: ASE; ComponentLink2URL: https://abracon.com/Oscillators/ASEseries.pdf; Category: Crys; RoHS: TRUE; Temperature Range High: +85°C; Octopart: https://octopart.com/ase-25.000mhz-lc-t-abracon-657858; Automotive: No; Device Class L1: Passive Components; Temperature Range Low: -40°C; Device Class L2: Crystals / Oscillators; Digikey Description: XTAL OSC XO 25.0000MHZ CMOS SMD; Temperature: -40°C to +85°C; Height: 1.2mm

## Sheet hwcb_2.SchDoc
size C; SheetNumber: 2; SheetTotal: 2
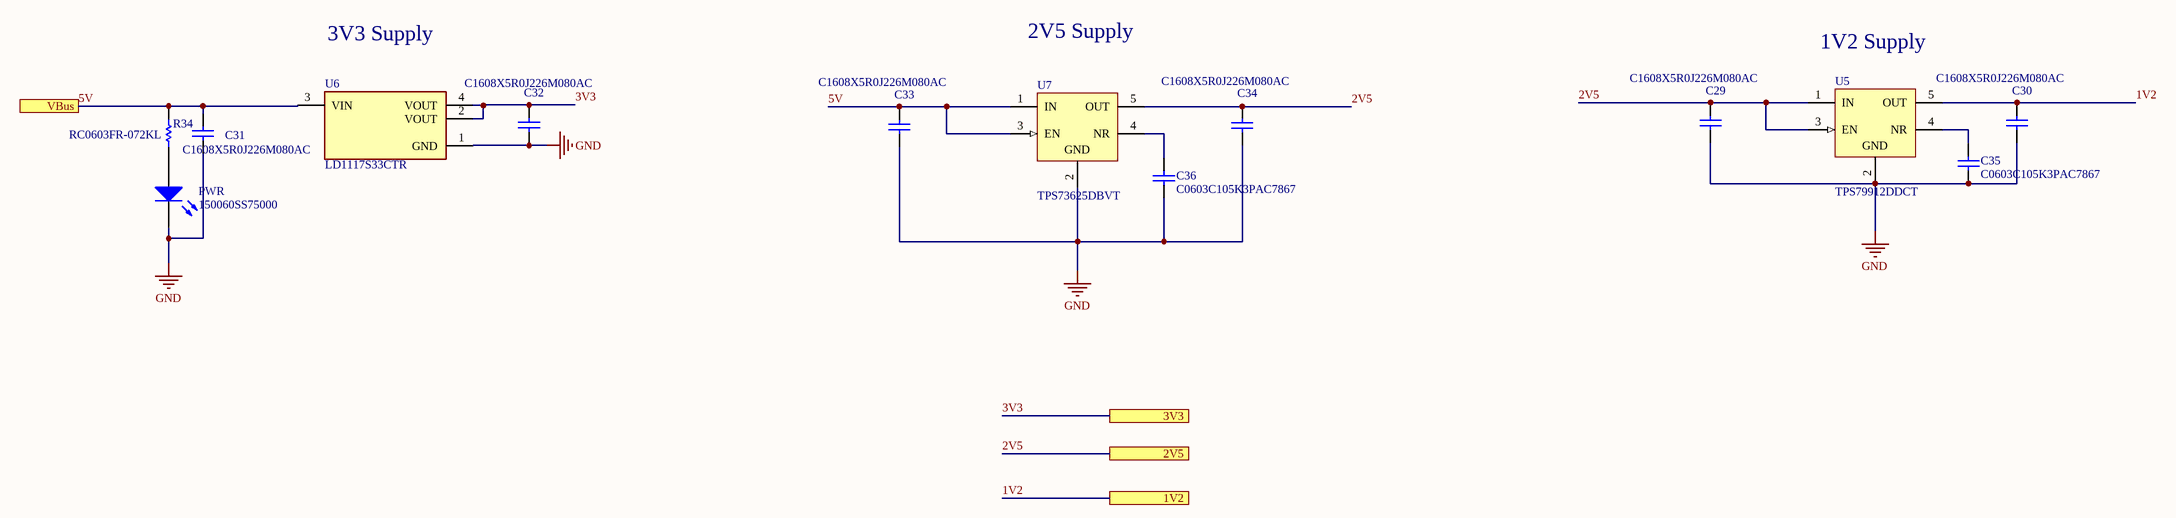
[diagram p2: hwcb_2.SchDoc]

### Parts
C29  C1608X5R0J226M080AC  [CAPC1608X100X20ML10]
C30  C1608X5R0J226M080AC  [CAPC1608X100X20ML10]
C31  C1608X5R0J226M080AC  [CAPC1608X100X20ML10]
C32  C1608X5R0J226M080AC  [CAPC1608X100X20ML10]
C33  C1608X5R0J226M080AC  [CAPC1608X100X20ML10]
C34  C1608X5R0J226M080AC  [CAPC1608X100X20ML10]
C35  C0603C105K3PAC7867  [CAPC1608X90X35LL15T15]
C36  C0603C105K3PAC7867  [CAPC1608X90X35LL15T15]
PWR  150060SS75000  [0603_A]
R34  RC0603FR-072KL  [RESC1608X55X25LL10T15]
U5  TPS79912DDCT  [DDC0005A_L]
U6  LD1117S33CTR  [FP-SOT-223-0046067_14-MFG]
U7  TPS73625DBVT  [DBV0005A_M]

### Ports
1V2, 2V5, 3V3, VBus

### Nets
GND: C29.1 C30.1 C31.1 C32.1 C33.1 C34.1 C35.2 C36.2 PWR.1(K) U5.2(GND) U6.1(GND) U7.2(GND)  [project net nCE]
1V2: C30.2 U5.5(OUT) ; port 1V2
2V5: C29.2 C34.2 U5.1(IN) U5.3(EN) U7.5(OUT) ; port 2V5
3V3: C32.2 U6.2(VOUT) U6.4(VOUT) ; port 3V3
5V: C31.2 C33.2 R34.1 U6.3(VIN) U7.1(IN) U7.3(EN) ; port VBus
NetC35_1: C35.1 U5.4(NR)
NetC36_1: C36.1 U7.4(NR)
NetPWR_2: PWR.2(A) R34.2

### Notes on the sheet
- 3V3 Supply
- 2V5 Supply
- (near U5) 1V2 Supply

### Library data of the parts
C29-C34 = CMP-2000-05440-1: as C1 on sheet hwcb; Tolerance: ±20%; Series: C; Thickness (Max): 0.039"(1.00mm); Mounting Type: SurfaceMount,MLCC; Ratings: -; Datasheet Version: Mar-15; Package Reference: 603; Packaging: CutTape(CT); Features: -; Package / Case: 0603(1608Metric); Family: CeramicCapacitors; Lead Spacing: -; RoHS Information: RoHSCertificate-MLCC; Manufacturer URL: http://www.tdk.com/; Lead Style: -; Category: Capacitors; Applications: GeneralPurpose; Package Description: 2-Pin Surface Mount Device, Body 1.6 x 0.8 mm; Standard Package: 1; Datasheet URL: http://www.farnell.com/datasheets/1913358.pdf; Height - Seated (Max): -; Operating Temperature: -55degC~85degC; Size / Dimension: 0.063"Lx0.031"W(1.60mmx0.80mm)
C35 C36 = CMP-2006-02216-2: Manufacturer: Kemet; Part Number: C0603C105K3PAC7867
PWR = CMP-1426-00004-1: SMD mono-color Chip LED, WL-SMCW, Super Red; Manufacturer: Wuerth Elektronik; PartNumber: 150060SS75000; ComponentLink2URL: http://katalog.we-online.com/led/datasheet/150060SS75000.pdf; ComponentLink2Description: Datasheet; PackageReference: 0603_A; ComponentLink1Description: Manufacturer URL; ComponentLink1URL: http://www.we-online.com; Color: Super Red
R34 = CMP-2000-06937-1: as R1 on sheet hwcb; Features: MoistureResistant; Height: 0.022"(0.55mm); Size / Dimension: 0.063"Lx0.031"W(1.60mmx0.80mm); Product Training Modules: ChipResistor; Mounting Technology: SurfaceMount; Package / Case: 0603(1608Metric); Supplier Device Package: 0603; Category: Resistors; Tolerance: ±1%; Packaging: CutTape(CT); Operating Temperature: -55°C~155°C; Standard Package: 1; Series: RC; Datasheet URL: http://www.yageo.com/documents/recent/PYu-RC_Group_51_RoHS_L_7.pdf; Package Description: 2-Pin Surface Mount Device, Body 1.6 x 0.8 mm; Number of Terminations: 2; Datasheet Version: Rev. 7, 05/2017; Package Reference: 0603; Composition: ThickFilm; Manufacturer URL: http://www.yageo.com/; Family: ChipResistor-SurfaceMount
U5 = CMP-0394-01099-2: Single Output High PSRR LDO, 200 mA, Fixed 1.2 V Output, 2.7 to 6.5 V Input, with Low IQ, 5-pin SOT (DDC), -40 to 125 degC, Green (RoHS & no Sb/Br); Manufacturer: Texas Instruments; Iq(Typ)(mA): 0.04; Vin(Min)(V): 2.7; Rating: Catalog; Vdo(Typ)(mV): 100; Vin(Max)(V): 6.5; Iout(Max)(A): 0.2; Vout Adj(Min)(V): 1.2; SubFamily: Single Channel LDO; Accuracy(%): 2; Mounting Technology: Surface Mount; Eco-Plan: Green (RoHS & no Sb/Br); ComponentLink3URL: http://www.ti.com/litv/pdf/mpds123d; PartNumber: TPS79912DDCT; PackageReference: DDC0005A; ComponentLink3Description: Package Specification; Code_JEDEC: MO-193; PackageDescription: 5-Pin Plastic Small Outline, Body 2.9 x 1.6 mm, 0.95 mm Pitch; ComponentLink1Description: Manufacturer URL; ComponentLink1URL: http://www.ti.com/; DatasheetVersion: SBVS056J; ComponentLink2Description: Datasheet; PackageVersion: 4204403-2/E; ComponentLink2URL: http://www.ti.com/general/docs/lit/getliterature.tsp?genericPartNumber=TPS79912&fileType=pdf; Fixed Output Options(V): 1.2; Vout Adj(Max)(V): 1.2
U6 = CMP-0244-00307-2: IC REG LINEAR 3.3V 800MA SOT223; Input Bias Current: 5mA; Output Voltage Accuracy: 1%; Dropout Voltage: 1.1V; Power Dissipation: 12W; Polarity: Positive; Min Input Voltage: 5.3V; Quiescent Current: 10mA; Max Output Current: 1.3A; Output Current: 950mA; Number of Regulators: 1; Max Supply Voltage: 15V; Output Type: Fixed; Output Voltage: 3.3V; Number of Terminals: 4; Min Supply Voltage: 3.3V; Termination: SMD/SMT; Mount: Surface Mount; Max Power Dissipation: 12W; Case/Package: SOT-223; Lead Free: Lead Free; Height: 1.8mm; REACH SVHC: No SVHC; Radiation Hardening: No; Width: 3.5mm; Length: 6.5mm; Packaging: Tape and Reel; Max Input Voltage: 15V; Accuracy: 1%; Weight: 0.01lb; Contact Plating: Tin; Max Operating Temperature: 125°C; Number of Pins: 4; Max Output Voltage: 3.3V; Min Operating Temperature: -40°C; Nominal Output Voltage: 3.3V; Package Quantity: 1; Min Output Voltage: 3.3V; Number of Outputs: 1
U7 = CMP-0395-00283-2: Single Output Low Noise LDO, 400 mA, Fixed 2.5 V Output, 1.7 to 5.5 V Input, with Reverse Current Protection, 5-pin SOT-23 (DBV), -40 to 85 degC, Green (RoHS & no Sb/Br); Manufacturer: Texas Instruments; Iout(Max)(A): 0.4; Fixed Output Options(V): 2.5; Rating: Catalog; Vdo(Typ)(mV): 75; Vin(Min)(V): 1.7; Accuracy(%): 1; Vin(Max)(V): 5.5; SubFamily: Single Channel LDO; Iq(Typ)(mA): 0.3; ComponentLink2URL: http://www.ti.com/general/docs/lit/getliterature.tsp?genericPartNumber=TPS73625&fileType=pdf; Vout Adj(Min)(V): 2.5; Vout Adj(Max)(V): 2.5; PackageReference: DBV0005A; Code_JEDEC: MO-178; ComponentLink3Description: Package Specification; ComponentLink2Description: Datasheet; ComponentLink1Description: Manufacturer URL; PartNumber: TPS73625DBVT; PackageDescription: 5-Pin Plastic Small Outline, Body 1.60 Ãƒâ€” 2.90 mm, Pitch 0.95 mm; Mounting Technology: Surface Mount; ComponentLink4URL: Samples URL:http://www.ti.com/product/tps73625#samples; DatasheetVersion: SBVS038T; ComponentLink3URL: http://www.ti.com/litv/pdf/mpds018i; Eco-Plan: Green (RoHS & no Sb/Br); PackageVersion: 4073253-4/K; ComponentLink4Description: URL Link1; ComponentLink1URL: http://www.ti.com/

## Nets that join several sheets
nCE: hwcb (100 pins), hwcb_2 (12 pins)
1V2: hwcb (20 pins), hwcb_2 (C30.2 U5.5)
2V5: hwcb (7 pins), hwcb_2 (5 pins)
3V3: hwcb (61 pins), hwcb_2 (C32.2 U6.2 U6.4)
5V: hwcb (D3.2 J9.A9 R22.2), hwcb_2 (6 pins)